# Altium schematic sheet Power.SchDoc: Наименование
size 420 x 297 mm; ApprovedBy: Утвердил; CheckedBy: Проверил; Author: Разработал; CompanyName: Организация; DrawnBy: Н.Контр; Engineer: Т.Контр; SheetNumber: 1; SheetTotal: 1; PageSetup: Record=PageOptions|CenterHorizontal=True|CenterVertical=True|PrintScale=0.94|XCorrection=1.00|YCorrection=1.00|PrintKind=1|BorderSize=5000000|LeftOffset=0|BottomOffset=0|Orientation=1|PaperLength=1000|PaperWidth=1000|Scale=100|PaperSource=7|PrintQuality=-4|MediaType=1|DitherType=10|PaperKind=A4|PrintScaleMode=1; DecimalNumber: Power; HeadOfSector: Нач. сектора; MainDevice: Перв.примен.; Name: Наименование; DocumentName: Sheet1.SCHDOC
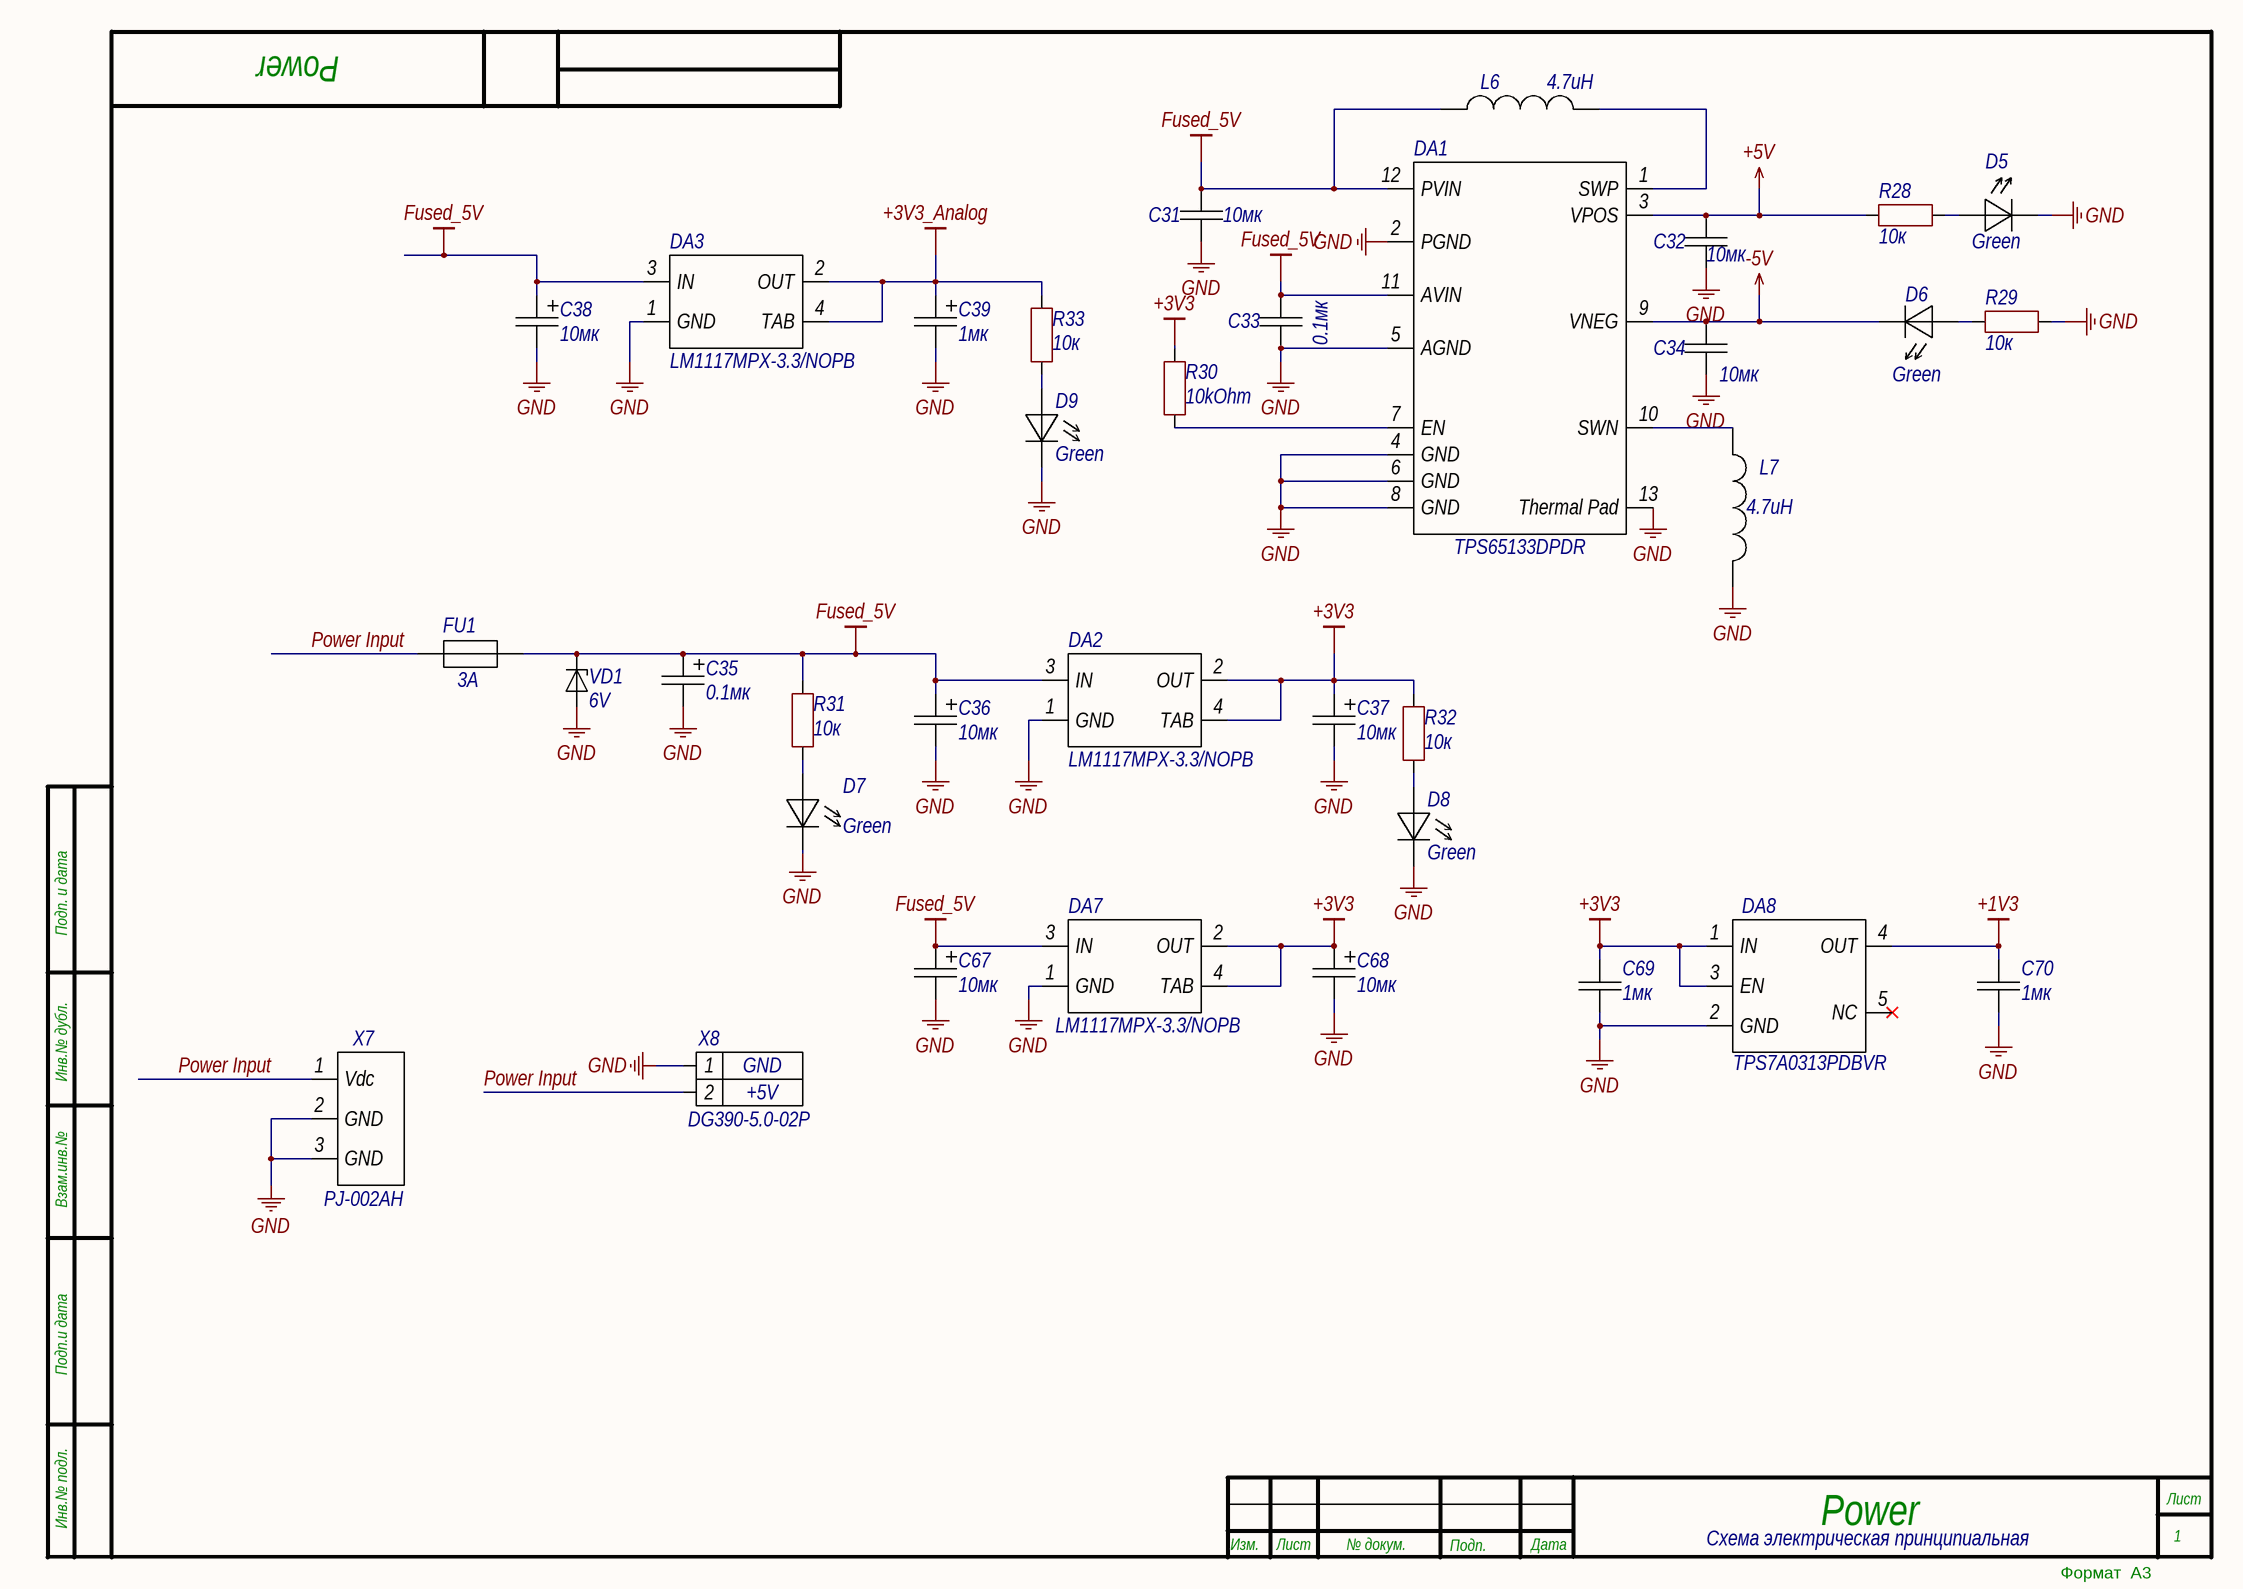
[diagram p0: Power.SchDoc]

## Parts
C31  value 10мк  [CAPC3216N]  (hidden comment: 10мк *)
C32  value 10мк  [CAPC3216N]  (hidden comment: 10мк *)
C33  value 0.1мк  [CAPC3216N]  (hidden comment: 0.1мк *)
C34  value 10мк  [CAPC3216N]  (hidden comment: 10мк *)
C35  value 0.1мк  [TYPEB]  (hidden comment: 0.1мк 10V)
C36  value 10мк  [TYPEA]  (hidden comment: 10мк 16V)
C37  value 10мк  [TYPEA]  (hidden comment: 10мк 16V)
C38  value 10мк  [TYPEA]  (hidden comment: 10мк 16V)
C39  value 1мк  [TYPEA]  (hidden comment: 1мк 16V)
C67  10мк  [TYPEA]
C68  10мк  [TYPEA]
C69  value 1мк  [CAP0402]  (hidden comment: 1мк *)
C70  value 1мк  [CAP0402]  (hidden comment: 1мк *)
D5  Green  [LED603]
D6  Green  [LED603]
D7  Green  [LED603]
D8  Green  [LED603]
D9  Green  [LED603]
DA1  TPS65133DPDR  [FP-DPD0012A-IPC_A]
DA2  MPN: LM1117MPX-3.3/NOPB  [SOT-223]  (hidden comment: LDO 5V to 3V3)
DA3  MPN: LM1117MPX-3.3/NOPB  [SOT-223]  (hidden comment: LDO 5V to 3V3)
DA7  LM1117MPX-3.3/NOPB  [SOT-223]
DA8  TPS7A0313PDBVR  [SOT-23-5]
FU1  value 3A  [FP-0154-MFG]  (hidden comment: Fuse: +5V power line)
L6  4.7uH  [ind_SRN8040]
L7  4.7uH  [ind_SRN8040]
R28  10к  [RESC0603N]
R29  10к  [RESC0603N]
R30  value 10kOhm  [RESC0603N]  (hidden comment: 10kOhm 0.1W)
R31  value 10к  [RESC0603N]  (hidden comment: 10к 0.1W)
R32  10к  [RESC0603N]
R33  10к  [RESC0603N]
VD1  value 6V  [DO-214AA]  (hidden comment: TVS: +5V power line)
X7  PJ-002AH  [PJ-002AH]
X8  DG390-5.0-02P  Wire2: +5V  Wire1: GND  [DG390-5.0-02P]

## Nets
+1V3: C70.2 DA8.4(OUT)
+3V3: C37.1 C68.1 C69.2 DA2.2(OUT) DA2.4(TAB) DA7.2(OUT) DA7.4(TAB) DA8.1(IN) DA8.3(EN) R30.2 R32.2
+3V3_Analog: C39.1 DA3.2(OUT) DA3.4(TAB) R33.2
+5V: C32.2 DA1.3(VPOS) R28.1
-5V: C34.2 D6.1(A) DA1.9(VNEG)
Fused_5V: C31.2 C33.2 C35.1 C36.1 C38.1 C67.1 DA1.11(AVIN) DA1.12(PVIN) DA2.3(IN) DA3.3(IN) DA7.3(IN) FU1.2 L6.1 R31.2 VD1.1
GND: C31.1 C32.1 C33.1 C34.1 C35.2 C36.2 C37.2 C38.2 C39.2 C67.2 C68.2 C69.1 C70.1 D5.1(A) D7.1(A) D8.1(A) D9.1(A) DA1.2(PGND) DA1.4(GND) DA1.5(AGND) DA1.6(GND) DA1.8(GND) DA1.13(Thermal_Pad) DA2.1(GND) DA3.1(GND) DA7.1(GND) DA8.2(GND) L7.2 R29.2 VD1.2 X7.2(GND) X7.3(GND) X8.1
Power Input: FU1.1 X7.1(Vdc) X8.2
NetD5_2: D5.2(K) R28.2
NetD6_2: D6.2(K) R29.1
NetD7_2: D7.2(K) R31.1
NetD8_2: D8.2(K) R32.1
NetD9_2: D9.2(K) R33.1
NetDA1_1: DA1.1(SWP) L6.2
NetDA1_7: DA1.7(EN) R30.1
NetDA1_10: DA1.10(SWN) L7.1

Not connected (* = marked no-connect by the designer): DA8 5(NC)*

## Notes on the sheet
- Схема электрическая принципиальная
- Подп. и дата
- Инв.№ дубл.
- Взам.инв.№
- Подп.и дата
- Инв.№ подл.
- Изм.
- Лист
- № докум.
- Подп.
- Дата
- Формат  A3

## Library data of the parts
C31-C34 = CAPC: MntType: SMD; MSL: MSL 1; Package: =Footprint; RoHS: Comply; PartType: CHIP CERAMIC CAPACITOR; Pins: 2; BOMDescription: =MntType+' '+PartType+' '+Package+' '+Value+' '+Tolerance+' '+Voltage+' '+TempCoeff+' '+MPN; CFootprint: =Footprint; Voltage: *; Part Number: CAPC; ClassName: Capacitor; ComponentLink1Description: Datasheet
C35 = Cap TANTAL: Manufacturer: KEMET; ManufacturerAlt: JLCPCB; MPN: T491B107M010AT; MPNAlt: C90975; MntType: SMD; Tolerance: 20%; Height: 1.9mm; MSL: MSL 1; Package: =Footprint; RoHS: Comply; Weight: 107.45mg; Voltage: 10V; PartType: CHIP TANTALUM CAPACITOR; Pins: 2; BOMDescription: =MntType+' '+PartType+' '+Package+' '+Value+' '+Tolerance+' '+Voltage+' '+TempCoeff+' '+MPN; CFootprint: =Footprint; Part Number: Cap TANTAL; ClassName: Capacitor; ComponentLink1Description: Datasheet; ComponentLink1Description: New link; ComponentLink1URL: https://content.kemet.com/datasheets/KEM_T2005_T491.pdf
C36-C39 = Cap TANTAL: Manufacturer: AVX; ManufacturerAlt: JLCPCB; MPN: TAJA106K016RNJ; MPNAlt: C7171; MntType: SMD; Tolerance: 10%; Height: 1.60; MSL: MSL 1; Package: =Footprint; RoHS: Comply; Voltage: 16V; PartType: CHIP TANTALUM CAPACITOR; Pins: 2; BOMDescription: =MntType+' '+PartType+' '+Package+' '+Value+' '+Tolerance+' '+Voltage+' '+TempCoeff+' '+MPN; CFootprint: =Footprint; Part Number: Cap TANTAL; ClassName: Capacitor; ComponentLink1Description: Datasheet; ComponentLink1Description: New link; ComponentLink1URL: https://datasheets.kyocera-avx.com/TAJ.pdf
C67 C68 = Cap TANTAL: MntType: SMD; MSL: MSL 1; Package: =Footprint; RoHS: Comply; PartType: CHIP TANTALUM CAPACITOR; Pins: 2; BOMDescription: =MntType+' '+PartType+' '+Package+' '+Value+' '+Tolerance+' '+Voltage+' '+TempCoeff+' '+MPN; CFootprint: =Footprint; Value: 10мк; PART NUMBER: Cap TANTAL; CLASSNAME: Capacitor; COMPONENTLINK1DESCRIPTION: Datasheet
C69 C70 = CAP0402: MntType: SMD; MSL: MSL 1; Package: =Footprint; RoHS: Comply; PartType: CHIP CERAMIC CAPACITOR; Pins: 2; BOMDescription: =MntType+' '+PartType+' '+Package+' '+Value+' '+Tolerance+' '+Voltage+' '+TempCoeff+' '+MPN; CFootprint: =Footprint; Voltage: *; PART NUMBER: CAP0402; CLASSNAME: Capacitor; COMPONENTLINK1DESCRIPTION: Datasheet
D5 D6 D8 D9 = LEDC: MntType: SMD; MSL: MSL 5; Package: =Footprint; RoHS: Comply; PartType: CHIP LED; Pins: 2; BOMDescription: =MntType+' '+PartType+' '+Package+' '+Value+' '+Tolerance+' '+Voltage+' '+TempCoeff+' '+MPN; CFootprint: =Footprint; Value: Green; PART NUMBER: LEDC; CLASSNAME: LED; COMPONENTLINK1DESCRIPTION: Datasheet
D7 = LEDC: Manufacturer: Everlight Elec; ManufacturerAlt: JLCPCB; MPN: 19-217/GHC-YR1S2/3T; MPNAlt: C72043; MntType: SMD; Power: 110mW; Voltage: 3.3V; Height: 0.4 mm; MSL: MSL 5; Package: =Footprint; RoHS: Comply; Weight: 118.61 mg; PartType: CHIP LED; Pins: 2; BOMDescription: =MntType+' '+PartType+' '+Package+' '+Value+' '+Tolerance+' '+Voltage+' '+TempCoeff+' '+MPN; CFootprint: =Footprint; Value: Green; Part Number: LEDC; ClassName: LED; ComponentLink1Description: Datasheet; ComponentLink1Description: New link; ComponentLink1URL: https://datasheet.lcsc.com/lcsc/1811101510_Everlight-Elec-19-217-GHC-YR1S2-3T_C72043.pdf
DA1 = TPS65133DPDR: Dual-Output Power Supply; Manufacturer: TI; Number of Channels: 2; Max Supply Voltage: 5V; Min Supply Voltage: 2.9V; Output Voltage: -5V; MntType: SMD; Mount: Surface Mount; Case/Package: QFN; Packaging: Tape and Reel; Lead Free: Lead Free; Radiation Hardening: No; Min Operating Temperature: -40°C; Number of Outputs: 2; Max Operating Temperature: 85°C; Number of Pins: 12; RoHS Compliant: Yes; Package Quantity: 3000; Part Number: TPS65133DPDR; Value: TPS65133DPDR; MPN: TPS65133DPDR; MSL: MSL 1; Package: WSON; RoHS: Comply; PartType: Switch Power; Pins: 13; BOMDescription: =MntType+' '+PartType+' '+Package+' '+Value+' '+Tolerance+' '+Voltage+' '+TempCoeff+' '+MPN; CFootprint: =Footprint; ClassName: Switch Power; ComponentLink1Description: Datasheet; ComponentLink1URL: https://www.ti.com/lit/ds/symlink/tps65133.pdf?ts=1627858987235&ref_url=https%253A%252F%252Fwww.google.com%252F
DA2 DA3 = LM1117MPX-3.3/NOPB: Manufacturer: Texas Instruments; ManufacturerAlt: JLCPCB; MPNAlt: C9662; BOMDescription: SMD LDO SOT-223 3.3V  15V  LM1117MPX-3.3/NOPB; MntType: SMD; Value: 3.3V; Voltage: 15V; CFootprint: =Footprint; Height: 35.0; MSL: MSL 1; Package: SOT-223; PartType: LDO; Pins: 4; RoHS: Comply; Part Number: LM1117MPX-3.3/NOPB; Weight: 290 mg; ClassName: LDO; ComponentLink1Description: Datasheet; ComponentLink1URL: https://www.ti.com/lit/ds/symlink/lm1117.pdf
DA7 = LM1117MPX-3.3/NOPB: Manufacturer: Texas Instruments; MPNAlt: C9662; BOMDescription: SMD LDO SOT-223 3.3V  3.3V  LM1117MPX-3.3/NOPB; MntType: SMD; Value: 3.3V; CFootprint: =Footprint; Height: 1,8; MPN: LM1117MPX-3.3/NOPB; MSL: MSL 1; Package: SOT-223; PartType: LDO; Pins: 4; RoHS: Comply; Voltage: 3.3V; PART NUMBER: LM1117MPX-3.3/NOPB; WEIGHT: 290 mg; CLASSNAME: LDO; COMPONENTLINK1DESCRIPTION: Datasheet; COMPONENTLINK1URL: https://www.ti.com/lit/ds/symlink/lm1117.pdf
DA8 = TPS7A0313PDBVR: Manufacturer: TI; Value: 1.3 V; MntType: SMD; MSL: MSL 1; Package: =Footprint; RoHS: Comply; PartType: LDO; Pins: 5; BOMDescription: =MntType+' '+PartType+' '+Package+' '+Value+' '+Tolerance+' '+Voltage+' '+TempCoeff+' '+MPN; CFootprint: =Footprint; ClassName: LDO; ComponentLink1Description: Datasheet; MPN: TPS7A0313PDBVR; PART NUMBER: TPS7A0313PDBVR; COMPONENTLINK1URL: https://www.ti.com/lit/ds/symlink/tps7a03.pdf
FU1 = 0154003.DR: Manufacturer: Littelfuse; ManufacturerAlt: JLCPCB; MPNAlt: C206912; MntType: SMD; Voltage: 125 V; Part Number: 0154003.DR; MPN: 0154003.DR; Height: 3.81 mm; MSL: MSL 1; Package: OMNI-BLOK; RoHS: Comply; Weight: 819.8 mg; PartType: Fuse; Pins: 2; BOMDescription: =MntType+' '+PartType+' '+Package+' '+Value+' '+Tolerance+' '+Voltage+' '+TempCoeff+' '+MPN; CFootprint: =Footprint; ComponentLink1Description: Datasheet; ComponentLink1URL: https://www.littelfuse.com/media?resourcetype=datasheets&itemid=1cd64ad0-b793-4012-8c75-7e2fefbc1368&filename=littelfuse-fuse-154-154t-154l-154tl-datasheet.pdf
L6 L7 = SRN8040-4R7Y: Manufacturer: Bourns; MntType: SMD; MPN: SRN8040-4R7Y; MSL: MSL 1; Package: =Footprint; RoHS: Comply; PartType: INDUCTOR; Pins: 2; BOMDescription: =MntType+' '+PartType+' '+Package+' '+Value+' '+Tolerance+' '+Voltage+' '+TempCoeff+' '+MPN; CFootprint: =Footprint; Value: 4.7uH; Part Number: SRN8040-4R7Y; ClassName: Inductor; ComponentLink1Description: Datasheet; ComponentLink1URL: https://spb.terraelectronica.ru/pdf/show?pdf_file=http%253A%252F%252Fwww.farnell.com%252Fdatasheets%252F1927816.pdf
R28 R29 R32 R33 = RES: MntType: SMD; MSL: MSL 1; Package: =Footprint; RoHS: Comply; PartType: CHIP RESISTOR; Pins: 2; BOMDescription: =MntType+' '+PartType+' '+Package+' '+Value+' '+Tolerance+' '+Voltage+' '+TempCoeff+' '+MPN; CFootprint: =Footprint; Value: 10к; PART NUMBER: RES; CLASSNAME: Resistor; COMPONENTLINK1DESCRIPTION: Datasheet
R30 R31 = RES: Manufacturer: UNI-ROYAL(Uniroyal Elec); ManufacturerAlt: JLCPCB; MPN: 0603WAF1002T5E; MPNAlt: C25804; MntType: SMD; Tolerance: 1%; Voltage: 75V; Height: 0.45; MSL: MSL 1; Package: =Footprint; Power: 0.1W; RoHS: Comply; PartType: CHIP RESISTOR; Pins: 2; BOMDescription: =MntType+' '+PartType+' '+Package+' '+Value+' '+Tolerance+' '+Voltage+' '+TempCoeff+' '+MPN; CFootprint: =Footprint; Part Number: RES; ClassName: Resistor; ComponentLink1Description: Datasheet; ComponentLink1Description: New link; ComponentLink1URL: https://datasheet.lcsc.com/lcsc/1811062009_UNI-ROYAL-Uniroyal-Elec-0603WAF1002T5E_C25804.pdf
VD1 = SMBJ6.0A: Manufacturer: RUILON(Shenzhen Ruilongyuan Elec); ManufacturerAlt: JLCPCB; MPNAlt: C10205; MntType: SMD; Power: 5W; Tolerance: 5%; Part Number: SMBJ6.0A; MPN: SMBJ6.0A; Height: 2.610 mm; MSL: MSL 1; Package: DO-214AA; RoHS: Comply; Weight: 93 mg; Voltage: 6V; PartType: Diode_zener; Pins: 2; BOMDescription: =MntType+' '+PartType+' '+Package+' '+Value+' '+Tolerance+' '+Voltage+' '+TempCoeff+' '+MPN; CFootprint: =Footprint; ClassName: Diode_zener; ComponentLink1Description: Datasheet; ComponentLink1URL: https://www.littelfuse.com/~/media/electronics/datasheets/tvs_diodes/littelfuse_tvs_diode_smbj_datasheet.pdf.pdf; ComponentLink2Description: Datasheet 2; ComponentLink2URL: https://datasheet.lcsc.com/lcsc/1809050331_RUILON-Shenzhen-Ruilongyuan-Elec-SMBJ6.0A_C10205.pdf
X7 = CUI_PJ-002AH: Manufacturer: CUI; MntType: DIP; MPN: PJ-002AH; MSL: MSL 1; Package: =Footprint; RoHS: Comply; PartType: CONNECTOR; Pins: 3; BOMDescription: =MntType+' '+PartType+' '+Package+' '+Value+' '+Tolerance+' '+Voltage+' '+TempCoeff+' '+MPN; CFootprint: =Footprint; Part Number: CUI_PJ-002AH
X8 = DG390-5.0-02P: Manufacturer: DEGSON; MntType: DIP; System: Connector; Part Number: DG390-5.0-02P; Value: DG390-5.0-02P; MPN: DG390-5.0-02P; MSL: MSL 1; RoHS: Comply; PartType: CONNECTOR; Pins: 2; BOMDescription: =MntType+' '+PartType+' '+Package+' '+Value+' '+Tolerance+' '+Voltage+' '+TempCoeff+' '+MPN; CFootprint: =Footprint; ClassName: Connector; ComponentLink1Description: Datasheet; ComponentLink1URL: https://www.degson.com/content/details_552_878975.html?lang=en